# EAGLE design IntegratedSensor (EAGLE 6.3)
Menlo Park Innovation LLC Sensor Front End Electronics
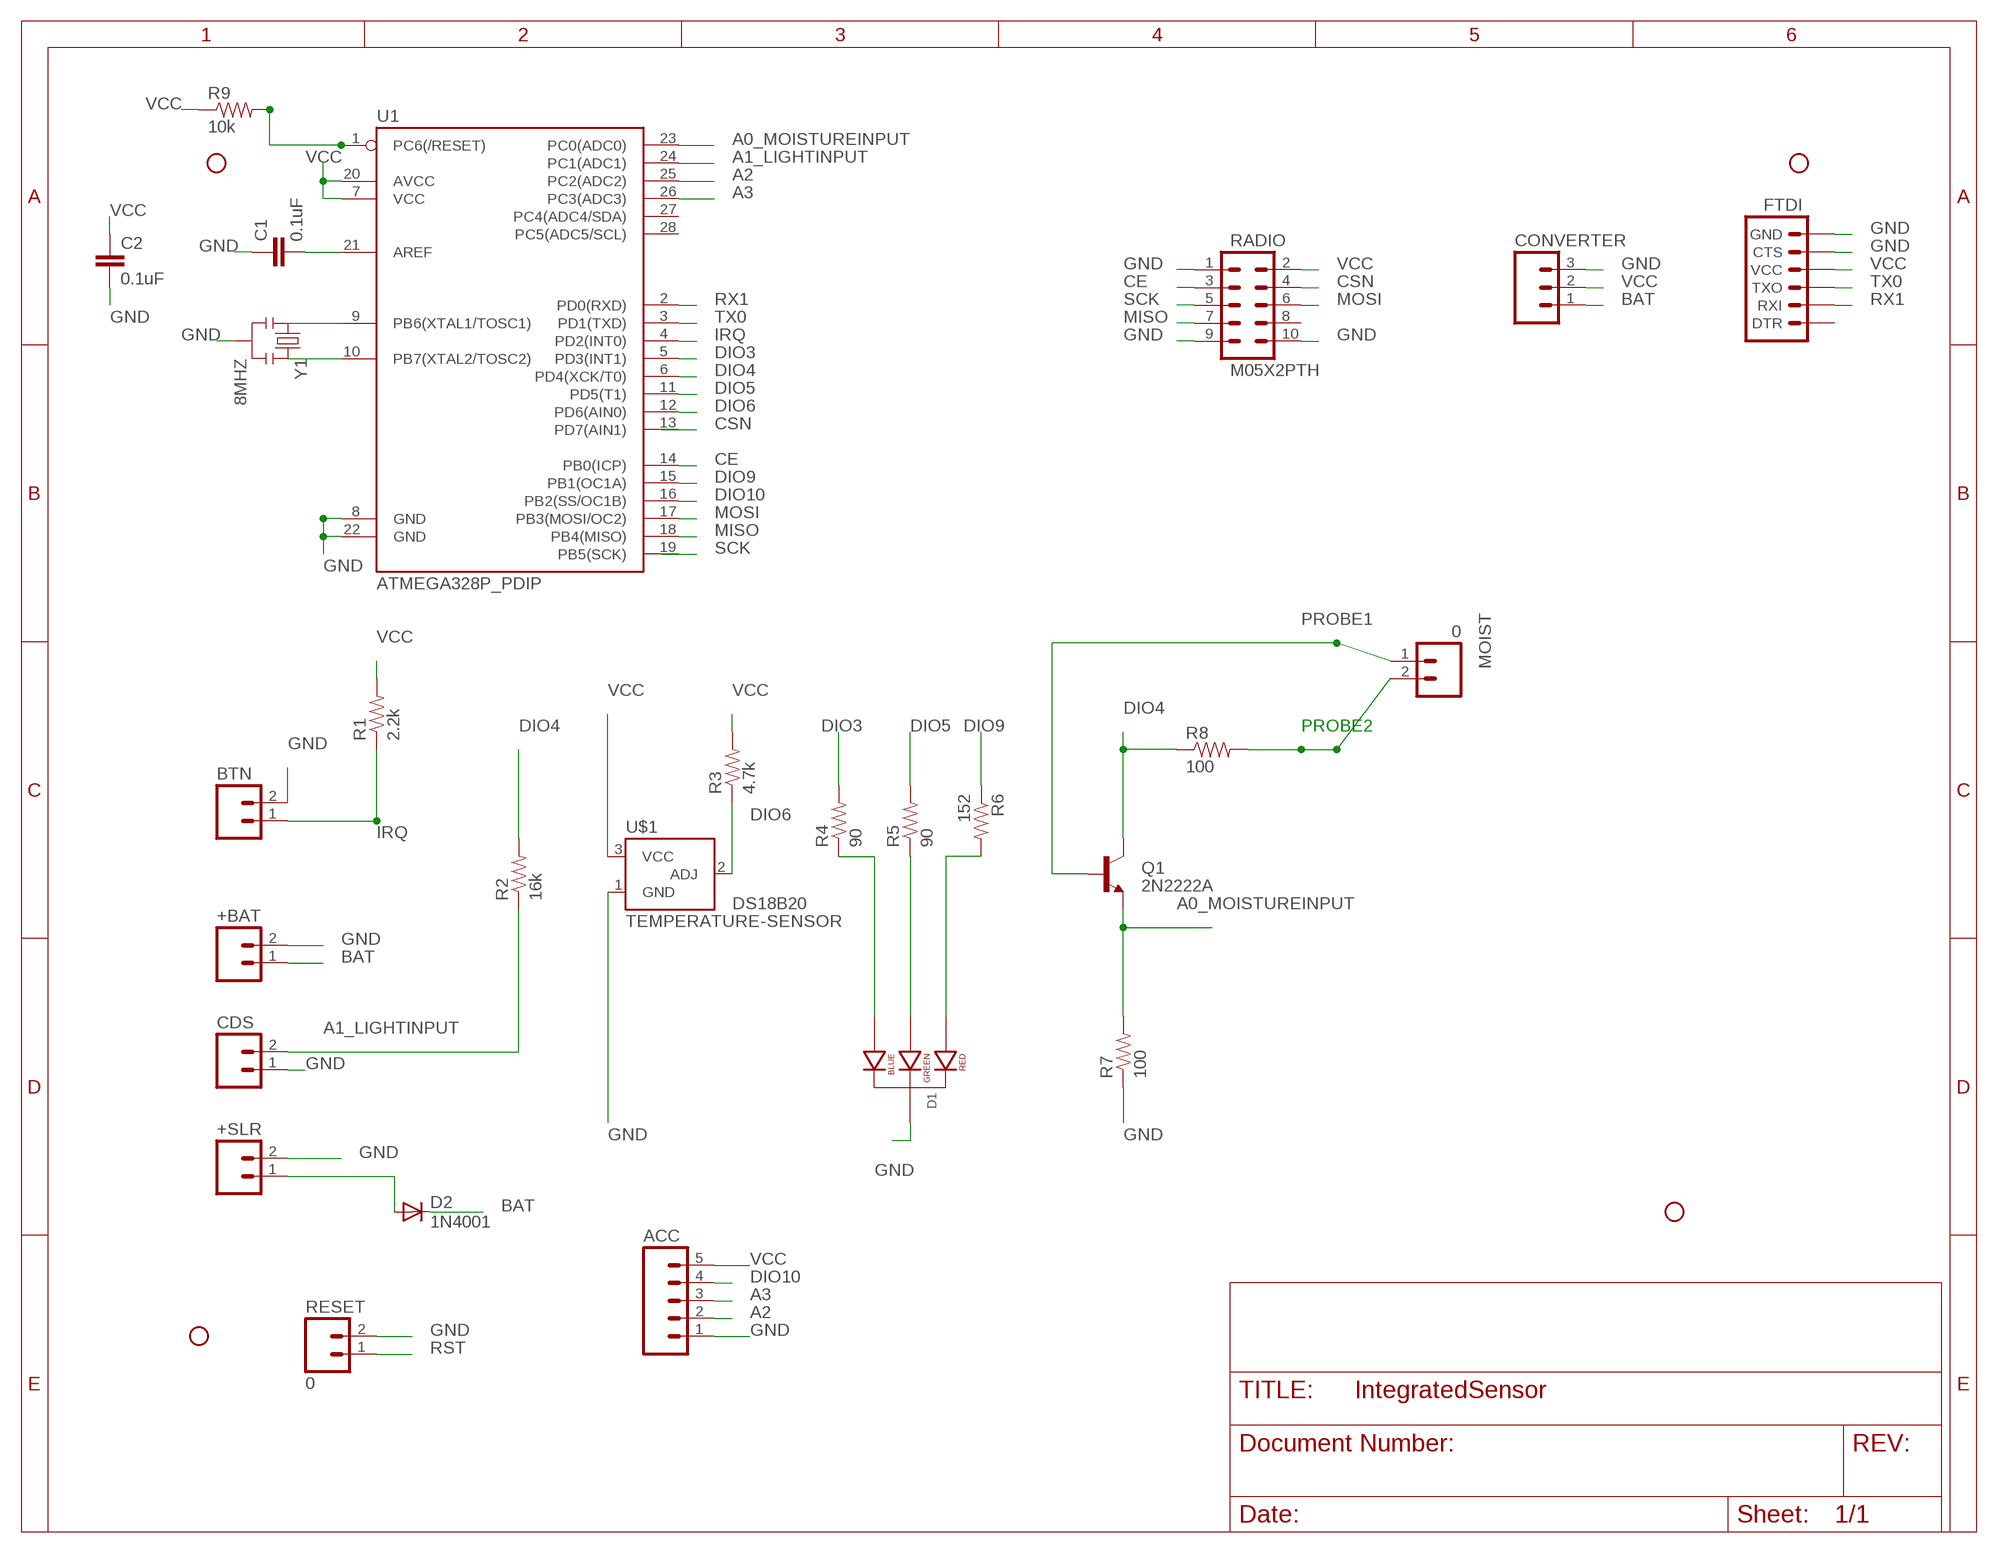
[diagram p0: schematic, sheet 1]

## Parts
+BAT  M02PTH  [1X02]
+SLR  M02PTH  [1X02]
ACC  M05PTH  [1X05]
BTN  M02PTH  [1X02]
C1  0.1uF  0.1UF-25V(+80/-20%)(0603)  [0402-CAP]
C2  0.1uF  0.1UF-25V(+80/-20%)(0603)  [0402-CAP]
CDS  M02PTH  [1X02]
CONVERTER  M03PTH  [1X03]
D1  LED-RGB-CC-THRUCLEAR  [LED-RGB-THRU]
D2  1N4001  DIODEPTH  [DIODE-1N4001]
FTDI  ARDUINO_SERIAL_PROGRAMPTH  [1X06]
MOIST  0  M02PTH  [1X02]
Q1  2N2222A  TRANSISTOR_NPNTO-92-AMMO  [TO-92-AMMO]
R1  2.2k  RESISTORPTH-1/6W  [1/6W-RES]
R2  16k  RESISTORPTH-1/6W  [1/6W-RES]
R3  4.7k  RESISTORPTH-1/6W  [1/6W-RES]
R4  90  RESISTORPTH-1/6W  [1/6W-RES]
R5  90  RESISTORPTH-1/6W  [1/6W-RES]
R6  152  RESISTORPTH-1/6W  [1/6W-RES]
R7  100  RESISTORPTH-1/6W  [1/6W-RES]
R8  100  RESISTORPTH-1/6W  [1/6W-RES]
R9  10k  RESISTORPTH-1/6W  [1/6W-RES]
RADIO  M05X2PTH  [AVR_ICSP]
RESET  0  M02PTH  [1X02]
STANDOFF1  STAND-OFF  [STAND-OFF]
STANDOFF2  STAND-OFF  [STAND-OFF]
STANDOFF3  STAND-OFF  [STAND-OFF]
STANDOFF4  STAND-OFF  [STAND-OFF]
U1  ATMEGA328P_PDIP  [DIL28-3]
U$1  TEMPERATURE-SENSOR  [TO-92]
Y1  8MHZ  RESONATOR8MHZ  [RESONATOR-SMD]

## Nets
A0_MOISTUREINPUT: Q1.1(E) R7.2 U1.23(PC0(ADC0))
A1_LIGHTINPUT: CDS.2 R2.1 U1.24(PC1(ADC1))
A2: ACC.2 U1.25(PC2(ADC2))
A3: ACC.3 U1.26(PC3(ADC3))
BAT: +BAT.1 CONVERTER.1 D2.C
CE: RADIO.3 U1.14(PB0(ICP))
CSN: RADIO.4
DIO3: R4.2 U1.5(PD3(INT1))
DIO4: Q1.3(C) R2.2 R8.1 U1.6(PD4(XCK/T0))
DIO5: R5.2 U1.11(PD5(T1))
DIO6: R3.1 U1.12(PD6(AIN0)) U$1.2(ADJ)
DIO9: R6.1 U1.15(PB1(OC1A))
DIO10: ACC.4 U1.16(PB2(SS/OC1B))
GND: +BAT.2 +SLR.2 ACC.1 BTN.2 C1.1 C2.2 CDS.1 CONVERTER.3 D1.2(CATHODE) FTDI.5(CTS) FTDI.6(GND) R7.1 RADIO.1 RADIO.9 RADIO.10 RESET.2 U1.8(GND) U1.22(GND) U$1.1(GND) Y1.2
IRQ: BTN.1 R1.1 U1.4(PD2(INT0))
MISO: RADIO.7 U1.18(PB4(MISO))
MOSI: RADIO.6 U1.17(PB3(MOSI/OC2))
N$1: D1.4(BLUE_CATHODE) R4.1
N$2: D1.3(GREEN_CATHODE) R5.1
N$3: D1.1(RED_CATHODE) R6.2
N$4: +SLR.1 D2.A
N$5: U1.9(PB6(XTAL1/TOSC1)) Y1.1
N$6: U1.10(PB7(XTAL2/TOSC2)) Y1.3
N$7: R9.2 U1.1(PC6(/RESET))
N$8: C1.2 U1.21(AREF)
PROBE1: MOIST.1 Q1.2(B)
PROBE2: MOIST.2 R8.2
RST: RESET.1
RX1: FTDI.2(RXI) U1.2(PD0(RXD))
SCK: RADIO.5
TX0: FTDI.3(TXO) U1.3(PD1(TXD))
VCC: ACC.5 C2.1 CONVERTER.2 FTDI.4(VCC) R1.2 R3.2 R9.1 RADIO.2 U1.7(VCC) U1.20(AVCC) U$1.3(VCC)
Unconnected: FTDI.1(DTR) RADIO.8 U1.13(PD7(AIN1)) U1.19(PB5(SCK)) U1.27(PC4(ADC4/SDA)) U1.28(PC5(ADC5/SCL))

## Library data of the parts
+BAT +SLR BTN CDS MOIST RESET = SparkFun-Connectors:M02: Header 2 Standard 2-pin 0.1" header. Use with straight break away headers (SKU : PRT-00116), right angle break away headers (PRT-00553), swiss pins (PRT-00743), machine pins (PRT-00117), and female headers (PRT-00115). Molex polarized connector foot print use with SKU : PRT-08233 with associated crimp pins and housings.
ACC = SparkFun-Connectors:M05: Header 5 Standard 5-pin 0.1" header. Use with straight break away headers (SKU : PRT-00116), right angle break away headers (PRT-00553), swiss pins (PRT-00743), machine pins (PRT-00117), and female headers (PRT-00115). Molex polarized connector foot print use with SKU : PRT-08230 with associated crimp pins and housings.
C1 C2 = SparkFun-Capacitors:0.1UF-25V(+80/-20%)(0603): Ceramic Standard decoupling cap CAP-00810; PROD_ID: CAP-00810
CONVERTER = SparkFun-Connectors:M03: Header 3 Standard 3-pin 0.1" header. Use with straight break away headers (SKU : PRT-00116), right angle break away headers (PRT-00553), swiss pins (PRT-00743), machine pins (PRT-00117), and female headers (PRT-00115). Molex polarized connector foot print use with SKU : PRT-08232 with associated crimp pins and housings.
D1 = SparkFun-LED:LED-RGB-CC-THRU: RGB Through-hole common cathode LED SparkFun Storefront: COM-00105 (Clear) COM-09264 (Diffuse); PROD_ID: DIO-08418
D2 = SparkFun-DiscreteSemi:DIODE: Diode These are standard reverse protection diodes and small signal diodes. SMA package can handle up to about 1A. SOD-323 can handle about 200mA. What the SOD-323 package when ordering, there are some mfgs out there that are 5-pin packages.
FTDI = SparkFun-Connectors:ARDUINO_SERIAL_PROGRAM: FTDI connector footprints
Q1 = SparkFun-DiscreteSemi:TRANSISTOR_NPN: Generic NPN BJT. MMBT2222 is the common NPN we use. Double check against datasheet- not all devices are the same!
R1-R9 = SparkFun-Resistors:RESISTOR: Resistor Basic schematic elements and footprints for 0603, 1206, and PTH resistors.
RADIO = SparkFun-Connectors:M05X2: Header 5x2 Standard 10-pin dual row 0.1" header. Commonly used with AVR-ISP. Use with Spark Fun Electronics SKU: PRT-00778
STANDOFF1-STANDOFF4 = SparkFun-Electromechanical:STAND-OFF: #4 Stand Off This is the mechanical footprint for a #4 phillips button head screw. Use the keepout ring to avoid running the screw head into surrounding components. SKU : PRT-00447
U1 = SparkFun-DigitalIC:ATMEGA328P_PDIP: uC used in the Arduino 32kb flash, 1k EEPROM, 2k SRAM This is the through-hole version of this chip.
U$1 = SparkFun-Sensors:TEMPERATURE-SENSOR: TO-92 temp sensor; PARTNAME: DS18B20
Y1 = SparkFun-FreqCtrl:RESONATOR: Resonator Small SMD resonator. Used, eg, on the Arduino Pro/ Pro Mini boards. 8MHz- XTAL-08895 16MHz- XTAL-08900; PROD_ID: XTAL-08895

## Board
MenloSensor1
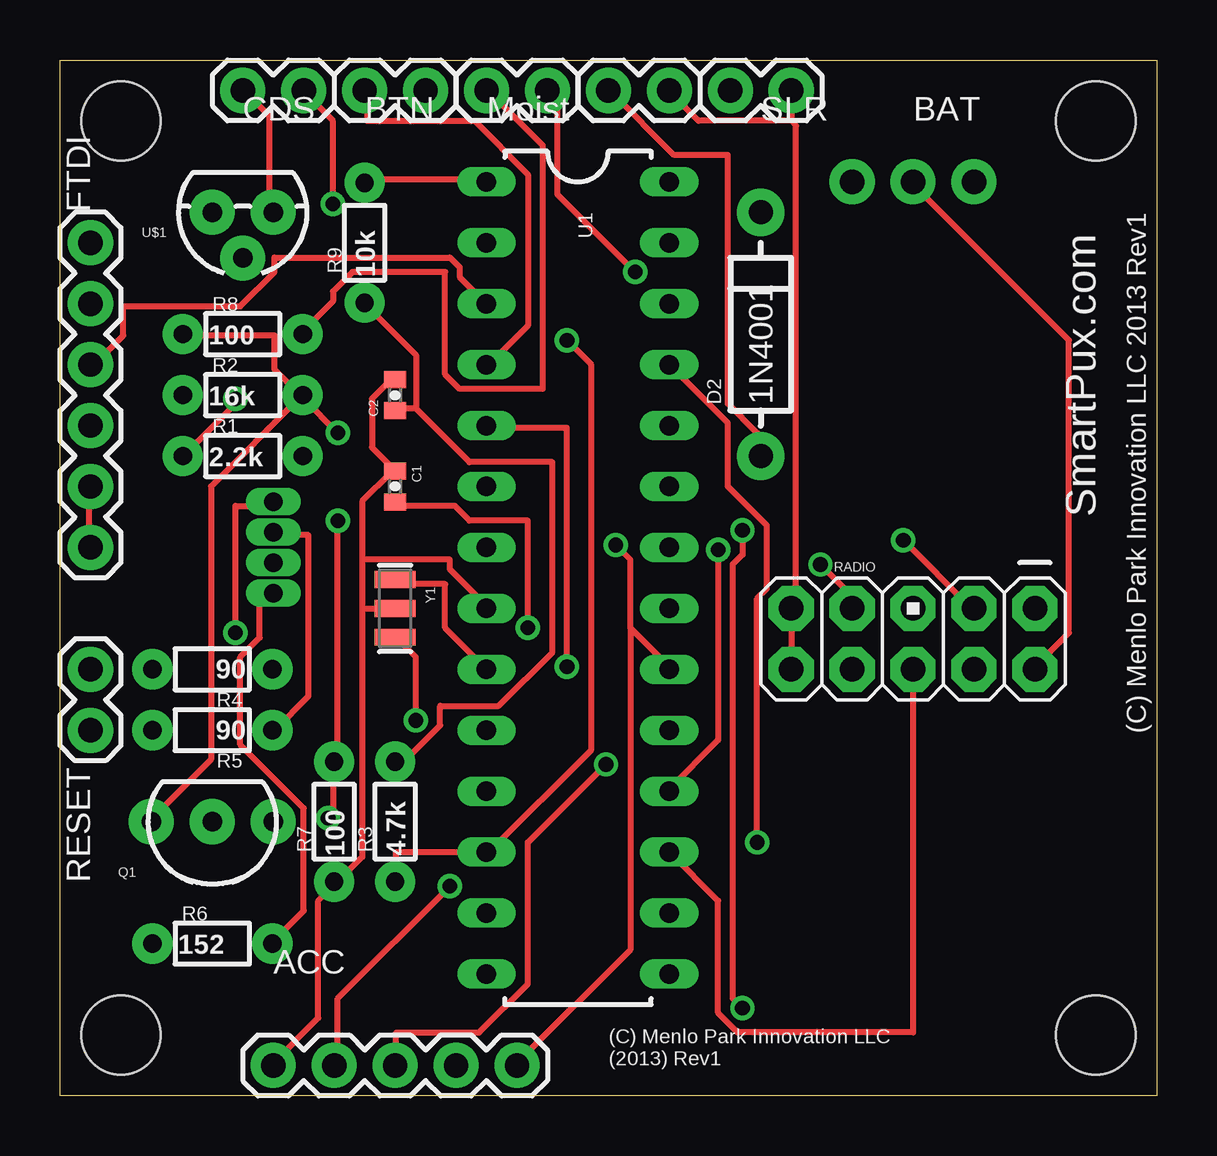
[diagram p1: board, top side]
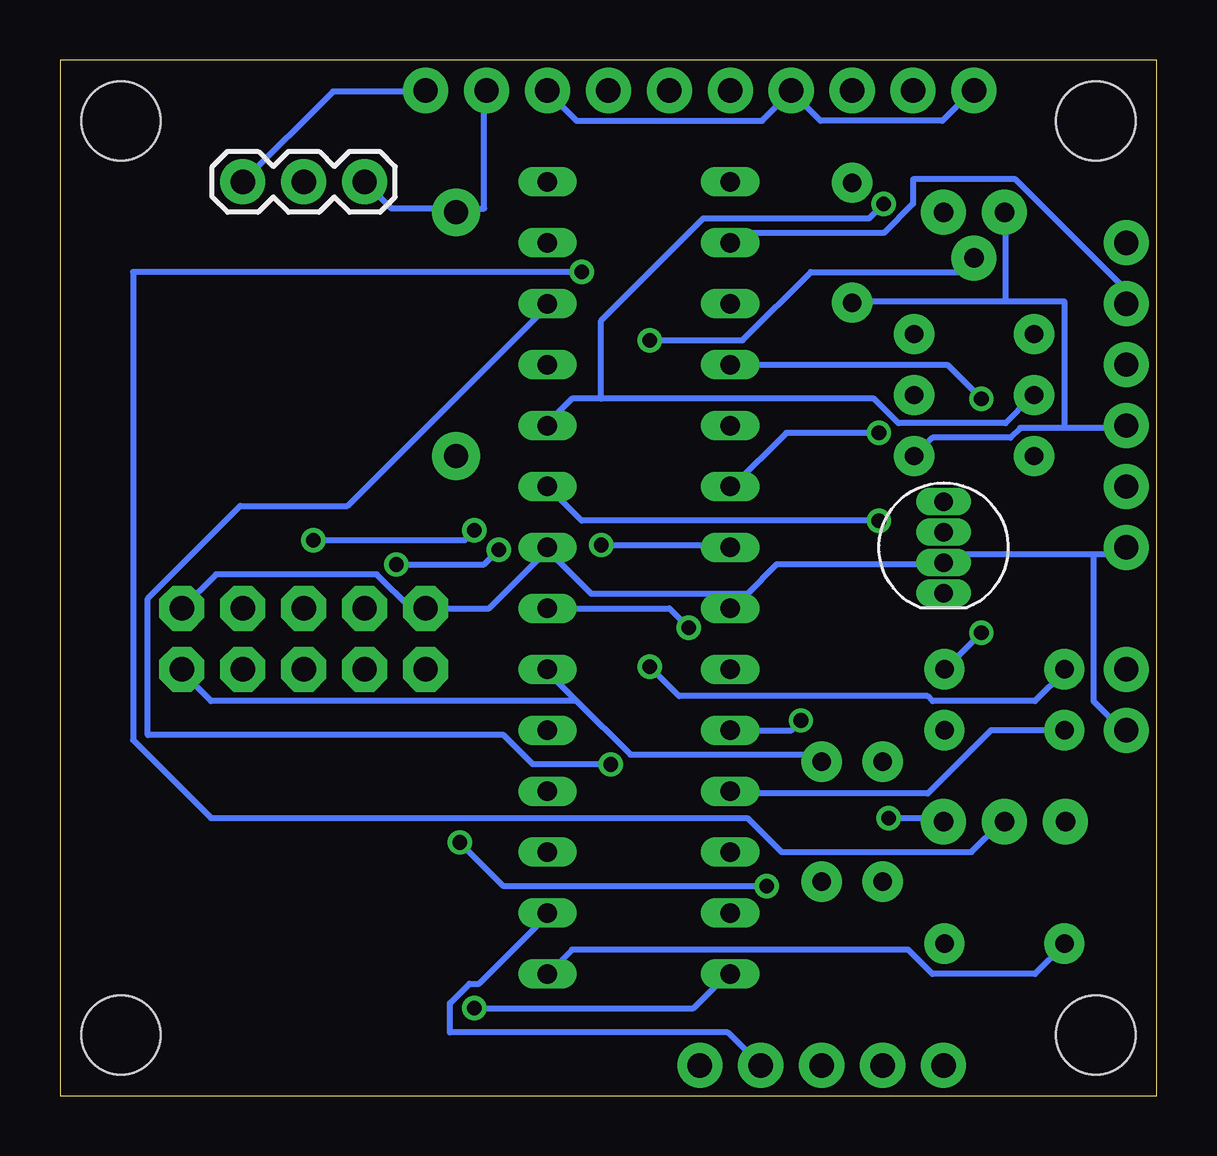
[diagram p2: board, bottom side, seen from below]

Size 45.72 x 43.18 mm. Coordinates in mm from the lower left corner, seen from the top.
Outline: 0,0 0,43.18 45.72,43.18 45.72,0 0,0
Copper layers (1*16): Top 0.035mm / dielectric 1.5mm / Bottom 0.035mm
Design rules "default *": minimum track width 10mil, minimum drill 24mil, track to track 8mil, track to pad 8mil, pad to pad 8mil, via to via 8mil, smd to smd 8mil, copper to edge 40mil, drill to drill 8mil, minimum pad ring 0mil, minimum via ring 8mil, stop-mask expansion 4mil, vias tented up to drill 0mil, thermal gap 10mil

### Footprints (pad centres in the part's own frame; a part is rotated, then mirrored left to right if it is on the bottom)
1X02 = drill 1.016 pad 1.88: 1 0,0; 2 2.54,0
1X05 = drill 1.016 pad 1.88: 1 0,0; 2 2.54,0; 3 5.08,0; 4 7.62,0; 5 10.16,0
0402-CAP = smd 0.7 x 0.9: 1 -0.65,0; 2 0.65,0
1X03 = drill 1.016 pad 1.88: 1 0,0; 2 2.54,0; 3 5.08,0
LED-RGB-THRU = drill 0.762 pad 0.889 long: 1 1.905,0; 2 0.635,0; 3 -0.635,0; 4 -1.905,0
DIODE-1N4001 = drill 1 pad 1.981: A -5.08,0; C 5.08,0
1X06 = drill 1.016 pad 1.88: 1 0,0; 2 2.54,0; 3 5.08,0; 4 7.62,0; 5 10.16,0; 6 12.7,0
TO-92-AMMO = drill 0.813 pad 1.88: 1 -2.54,0; 2 0,0; 3 2.54,0
1/6W-RES = drill 0.762 pad 1.676: 1 -2.5,0; 2 2.5,0
AVR_ICSP = drill 1.016 pad 1.88 octagon: 1 -1.27,5.08; 2 1.27,5.08; 3 -1.27,2.54; 4 1.27,2.54; 5 -1.27,0; 6 1.27,0; 7 -1.27,-2.54; 8 1.27,-2.54; 9 -1.27,-5.08; 10 1.27,-5.08
STAND-OFF = hole 3.302: 0,0
DIL28-3 = drill 0.813 long: 1 -16.51,-3.81; 2 -13.97,-3.81; 3 -11.43,-3.81; 4 -8.89,-3.81; 5 -6.35,-3.81; 6 -3.81,-3.81; 7 -1.27,-3.81; 8 1.27,-3.81; 9 3.81,-3.81; 10 6.35,-3.81; 11 8.89,-3.81; 12 11.43,-3.81; 13 13.97,-3.81; 14 16.51,-3.81; 15 16.51,3.81; 16 13.97,3.81; 17 11.43,3.81; 18 8.89,3.81; 19 6.35,3.81; 20 3.81,3.81; 21 1.27,3.81; 22 -1.27,3.81; 23 -3.81,3.81; 24 -6.35,3.81; 25 -8.89,3.81; 26 -11.43,3.81; 27 -13.97,3.81; 28 -16.51,3.81
TO-92 = drill 0.813 pad 1.88: 1 -1.27,0; 2 0,1.905; 3 1.27,0
RESONATOR-SMD = smd 0.7 x 1.7: 1 -1.2,0; 2 0,0; 3 1.2,0

### Placement (x,y rotation side)
+BAT  27.94,41.91 0 top
+SLR  22.86,41.91 0 top
ACC  8.89,1.27 0 top
BTN  12.7,41.91 0 top
C1  13.97,25.4 270 top
C2  13.97,29.21 90 top
CDS  7.62,41.91 0 top
CONVERTER  33.02,38.1 180 bottom
D1  8.89,22.86 270 bottom
D2  29.21,31.75 90 top
FTDI  1.27,35.56 270 top
MOIST  20.32,41.91 180 top
Q1  6.35,11.43 180 top
R1  7.62,26.67 0 top
R2  7.62,29.21 0 top
R3  13.97,11.43 90 top
R4  6.35,17.78 180 top
R5  6.35,15.24 180 top
R6  6.35,6.35 0 top
R7  11.43,11.43 90 top
R8  7.62,31.75 0 top
R9  12.7,35.56 90 top
RADIO  35.56,19.05 270 top
RESET  1.27,17.78 270 top
STANDOFF1  43.18,40.64 0 top
STANDOFF2  2.54,40.64 0 top
STANDOFF3  2.54,2.54 0 top
STANDOFF4  43.18,2.54 0 top
U1  21.59,21.59 270 top
U$1  7.62,36.83 180 top
Y1  13.97,20.32 270 top

### Tracks (layer width: path | path; a pad name or v marks a point on that pad's centre or on a via)
A0_MOISTUREINPUT  (via drill 0.61)
  Top 0.254: v11.58,23.98 11.58,14.02 R7.2 11.38,13.82 11.38,11.79 v11.18,11.58
  Bottom 0.254: U1.23 23.98,23.98 v11.58,23.98 | v11.18,11.58 8.94,11.58 Q1.1
A1_LIGHTINPUT  (via drill 0.61)
  Top 0.254: v11.38,37.19 11.38,40.64 10.16,41.86 CDS.2
  Bottom 0.254: 23.16,29.06 11.79,29.06 10.77,28.04 6.3,28.04 5.28,29.06 R2.1 | 23.16,29.06 24.38,29.06 25.4,28.04 U1.24 | v11.38,37.19 11.99,36.58 18.9,36.58 23.16,32.31 23.16,29.06
A2  (via drill 0.61)
  Top 0.254: U1.25 27.84,28.04 27.84,25.4 29.46,23.77 29.46,21.13 29.06,20.73 v29.06,10.57 | v16.26,8.74 11.58,4.06 11.58,1.42 ACC.2
  Bottom 0.254: v29.06,10.57 27.23,8.74 v16.26,8.74
A3  (via drill 0.61)
  Top 0.254: v22.76,13.82 19.51,10.57 19.51,4.67 17.48,2.64 14.02,2.64 14.02,1.42 ACC.3
  Bottom 0.254: v22.76,13.82 26.01,13.82 27.23,15.04 42.06,15.04 42.06,20.73 38.2,24.59 33.73,24.59 25.4,32.92 U1.26
BAT
  Bottom 0.254: +BAT.1 28.04,41.86 28.04,36.98 29.06,36.98 D2.C 29.26,36.98 31.9,36.98 CONVERTER.1
CE  (via drill 0.61)
  Top 0.254: v28.45,3.66 28.04,4.06 28.04,22.15 28.45,22.55 v28.45,23.57 | v35.15,23.16 38,20.32 RADIO.3
  Bottom 0.254: v28.45,3.66 19.3,3.66 17.88,5.08 U1.14 | v28.45,23.57 28.85,23.16 v35.15,23.16
DIO3  (via drill 0.61)
  Top 0.254: v21.13,17.88 21.13,27.84 17.88,27.84 U1.5
  Bottom 0.254: v21.13,17.88 19.91,16.66 9.55,16.66 9.35,16.46 5.08,16.46 3.86,17.68 R4.2
DIO4  (via drill 0.61)
  Top 0.254: v11.58,27.64 10.16,29.06 R2.2 | R8.1 5.28,31.7 8.94,31.7 8.94,30.28 9.96,29.26 R2.2 | Q1.3 3.86,11.58 6.3,14.02 6.3,25.4 9.96,29.06 R2.2
  Bottom 0.254: v11.58,27.64 15.44,27.64 17.68,25.4 U1.6
DIO5
  Bottom 0.254: R5.2 6.91,15.24 9.55,12.6 17.68,12.6 U1.11
DIO6  (via drill 0.61)
  Top 0.254: R3.1 14.02,8.94 14.02,10.16 U1.12 17.88,10.16 22.15,14.43 22.15,30.48 v21.13,31.5
  Bottom 0.254: v21.13,31.5 17.27,31.5 14.43,34.34 8.13,34.34 7.72,34.75 U$1.2
DIO9
  Bottom 0.254: U1.15 24.38,6.1 10.36,6.1 9.35,5.08 5.08,5.08 3.86,6.3 R6.1
DIO10
  Bottom 0.254: ACC.4 17.88,2.64 29.46,2.64 29.46,3.86 28.65,4.67 28.25,4.67 25.4,7.52 U1.16
GND
  Top 0.254: CDS.1 7.72,41.86 8.74,40.84 8.74,36.98 U$1.1 | 30.48,40.64 26.62,40.64 25.4,41.86 +SLR.2 | +BAT.2 30.48,40.64 | RADIO.10 RADIO.9 30.68,20.52 30.68,40.44 30.48,40.64 | ACC.1 8.94,1.42 10.77,3.25 10.77,8.13 11.38,8.74 R7.1 11.58,8.94 12.6,9.96 12.6,20.32 | C2.2 13.82,29.87 13.01,29.06 13.01,27.03 13.82,26.21 C1.1 13.82,26.01 12.6,24.79 12.6,22.35 | 12.6,20.32 Y1.2 | 12.6,22.35 12.6,20.32 | FTDI.5 1.22,25.4 1.22,22.96 FTDI.6 | 12.6,22.35 16.26,22.35 16.26,21.95 17.68,20.52 17.68,20.32 U1.8
  Bottom 0.254: 15.24,41.86 14.02,40.64 8.94,40.64 7.72,41.86 CDS.1 | CONVERTER.3 34.34,41.86 30.48,41.86 +BAT.2 | 15.24,41.86 16.46,40.64 24.18,40.64 25.4,41.86 +SLR.2 | 15.24,41.86 BTN.2 | 25.4,22.76 27.84,20.32 RADIO.9 31.09,20.32 32.51,21.74 39.22,21.74 RADIO.1 | 2.64,22.55 1.63,22.55 1.42,22.76 FTDI.6 | 2.64,22.55 8.53,22.55 8.74,22.35 D1.2 8.94,22.15 15.85,22.15 17.07,20.93 | 17.07,20.93 17.68,20.32 U1.8 | 2.64,22.55 2.64,16.46 1.42,15.24 RESET.2 | 25.4,22.76 23.57,20.93 17.07,20.93 | 25.4,22.76 U1.22
IRQ  (via drill 0.61)
  Top 0.254: U1.4 17.88,30.48 19.51,32.11 19.51,38.41 17.27,40.64 12.8,40.64 12.8,41.86 BTN.1 | v7.32,29.06 7.32,28.85 5.28,26.82 R1.1
  Bottom 0.254: v7.32,29.06 8.74,30.48 U1.4
MISO  (via drill 0.61)
  Top 0.254: v27.43,22.76 27.43,14.83 25.4,12.8 U1.18 | v31.7,22.15 32.92,20.93 32.92,20.32 RADIO.7
  Bottom 0.254: v27.43,22.76 28.04,22.15 v31.7,22.15
MOSI
  Top 0.254: U1.17 27.43,8.13 27.43,3.45 28.25,2.64 35.56,2.64 RADIO.6
N$1  (via drill 0.61)
  Top 0.254: v7.32,19.3 7.32,24.59 8.74,24.59 D1.4
  Bottom 0.254: v7.32,19.3 8.74,17.88 R4.1
N$2
  Top 0.254: D1.3 8.94,23.37 10.36,23.37 10.36,16.66 8.94,15.24 R5.1
N$3
  Top 0.254: D1.1 8.74,20.93 8.33,20.52 8.33,19.1 7.52,18.29 7.52,14.63 10.16,11.99 10.16,7.72 8.94,6.5 R6.2
N$4
  Top 0.254: +SLR.1 22.96,41.86 25.6,39.22 27.84,39.22 27.84,28.85 29.06,27.64 29.06,26.82 D2.A
N$5
  Top 0.254: U1.9 16.05,19.51 16.05,21.34 14.02,21.34 Y1.1
N$6  (via drill 0.61)
  Top 0.254: v14.83,15.65 14.83,18.29 14.02,19.1 Y1.3
  Bottom 0.254: v14.83,15.65 15.24,15.24 U1.10
N$7
  Top 0.254: U1.1 17.68,38.2 12.8,38.2 R9.2
N$8  (via drill 0.61)
  Top 0.254: v19.51,19.51 19.51,23.98 17.07,23.98 16.46,24.59 14.02,24.59 C1.2
  Bottom 0.254: v19.51,19.51 20.32,20.32 U1.21
PROBE1  (via drill 0.61)
  Top 0.254: v23.98,34.34 20.73,37.59 20.73,41.45 20.32,41.86 MOIST.1
  Bottom 0.254: v23.98,34.34 42.67,34.34 42.67,14.83 39.42,11.58 17.07,11.58 15.65,10.16 7.72,10.16 6.5,11.38 Q1.2
PROBE2
  Top 0.254: R8.2 10.16,31.9 11.38,33.12 11.38,33.53 12.19,34.34 16.05,34.34 16.05,30.07 16.66,29.46 20.12,29.46 20.12,39.62 17.88,41.86 MOIST.2
RX1
  Bottom 0.254: U1.2 17.68,35.56 17.27,35.97 11.38,35.97 10.16,37.19 10.16,38.2 5.89,38.2 1.42,33.73 1.42,33.12 FTDI.2
TX0
  Top 0.254: U1.3 16.66,34.14 16.66,34.54 16.26,34.95 8.94,34.95 8.94,34.34 7.52,32.92 2.64,32.92 2.64,31.7 1.42,30.48 FTDI.3
VCC  (via drill 0.61)
  Top 0.254: 14.83,28.65 14.02,28.65 C2.1 | 14.83,28.65 14.83,30.89 12.8,32.92 R9.1 | v23.16,22.96 23.77,22.35 23.77,19.51 | 23.77,19.51 25.4,17.88 U1.20 | 23.77,19.51 23.77,6.1 19.1,1.42 ACC.5 | CONVERTER.2 35.56,38 42.06,31.5 42.06,19.3 40.64,17.88 RADIO.2 | 14.83,28.65 17.07,26.42 20.52,26.42 20.52,18.49 18.29,16.26 15.85,16.26 15.85,15.44 14.43,14.02 14.02,14.02 R3.2
  Bottom 0.254: 3.86,27.84 1.42,27.84 FTDI.4 | 3.86,27.84 5.69,27.84 6.1,27.43 9.35,27.43 9.96,26.82 R1.2 | 6.3,33.12 6.3,36.78 U$1.3 | 6.3,33.12 12.6,33.12 R9.1 | 3.86,27.84 3.86,33.12 6.3,33.12 | v23.16,22.96 17.88,22.96 U1.7 | 24.18,16.46 25.4,17.68 U1.20 | 24.18,16.46 21.95,14.22 14.22,14.22 14.02,14.02 R3.2 | 24.18,16.46 39.42,16.46 40.64,17.68 RADIO.2

### Text on the board
tPlace: CDS | BTN | Moist | SLR | BAT | FTDI | (C) Menlo Park Innovation LLC 2013 Rev1 | SmartPux.com | RESET | ACC | (C) Menlo Park Innovation LLC / (2013) Rev1